# EAGLE design projetEagleElecGroupeD (EAGLE 9.6.2)
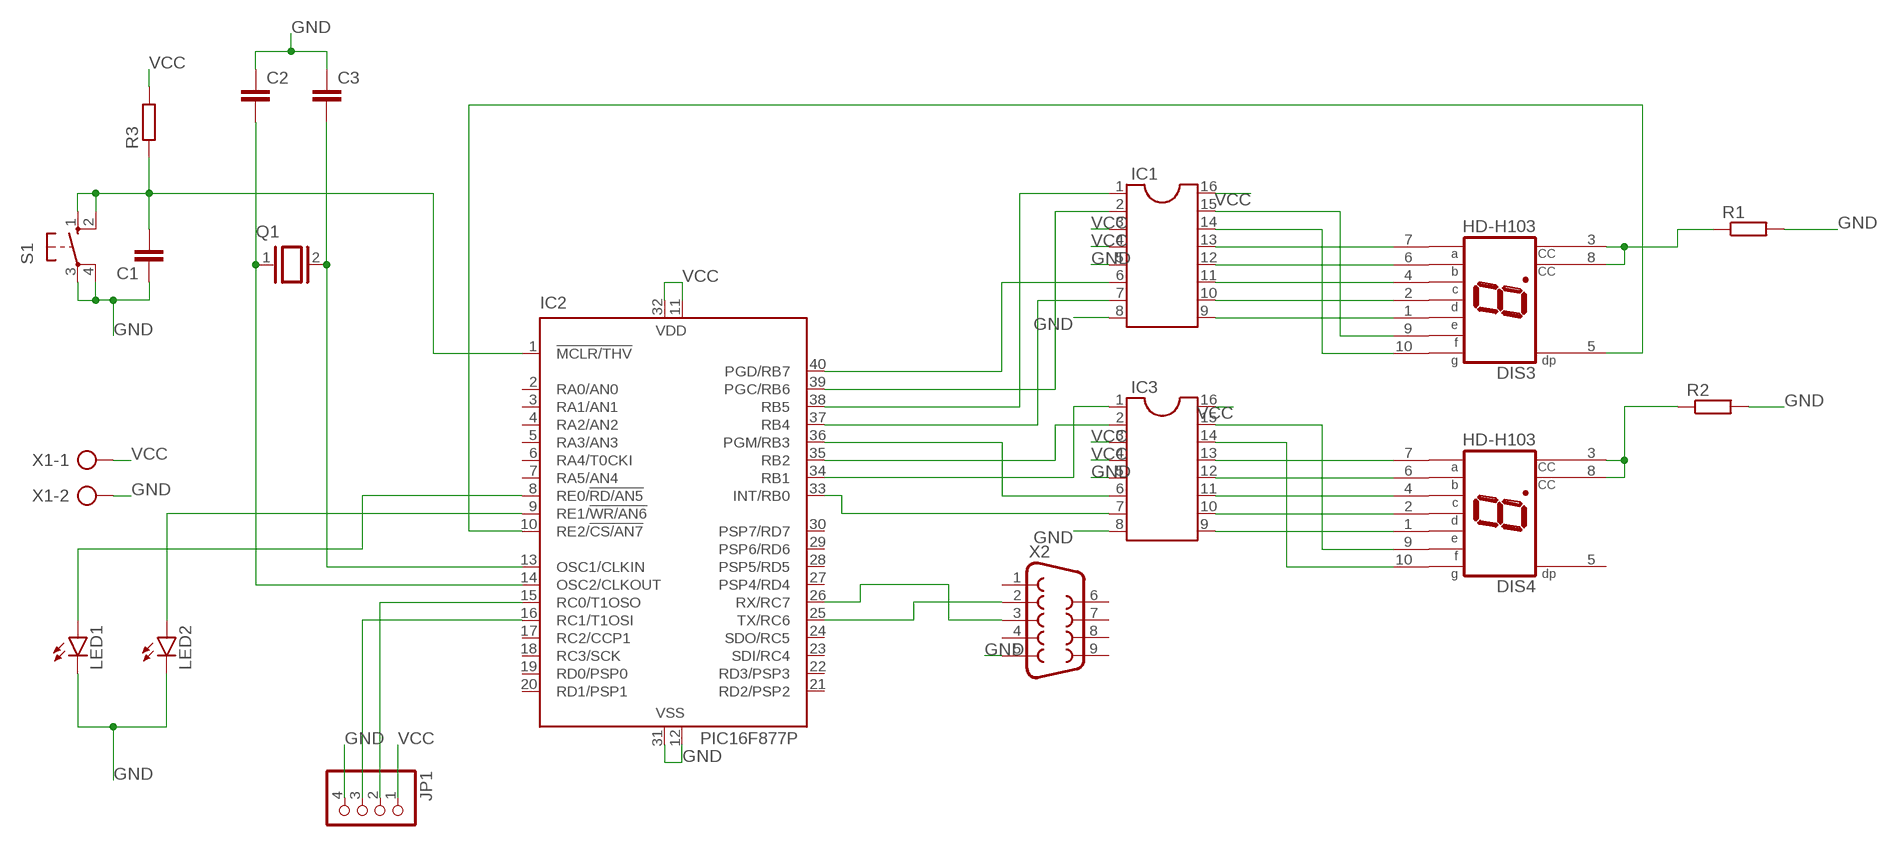
[diagram p0: schematic, sheet 1]

## Parts
C1  C-EU025-025X050  [C025-025X050]
C2  C-EU025-025X050  [C025-025X050]
C3  C-EU025-025X050  [C025-025X050]
DIS3  HD-H103  [HDSP-M]
DIS4  HD-H103  [HDSP-M]
IC1  DIL16  [DIL16]
IC2  PIC16F877P  [DIL40]
IC3  DIL16  [DIL16]
JP1  PINHD-1X4  [1X04]
LED1  LED5MM  [LED5MM]
LED2  LED5MM  [LED5MM]
Q1  XTAL/S  [QS]
R1  R-EU_0207/10  [0207/10]
R2  R-EU_0207/10  [0207/10]
R3  R-EU_0207/10  [0207/10]
S1  10-XX  [B3F-10XX]
X1  AK300/2  [AK300/2]
X2  F09H  [F09H]

## Nets
GND: C1.1 C2.1 C3.1 IC1.5 IC1.8 IC2.12(VSS) IC2.31(VSS) IC3.5 IC3.8 JP1.4 LED1.K(C) LED2.K(C) R1.2 R2.2 S1.3(P) S1.4(P1) X1.2 X2.5
N$1: IC2.25(TX/RC6) X2.2
N$2: IC2.26(RX/RC7) X2.3
N$3: IC1.7 IC2.37(RB4)
N$4: IC1.1 IC2.38(RB5)
N$5: IC1.2 IC2.39(PGC/RB6)
N$6: IC1.6 IC2.40(PGD/RB7)
N$7: IC2.33(INT/RB0) IC3.7
N$8: IC2.34(RB1) IC3.1
N$9: IC2.35(RB2) IC3.2
N$10: IC2.36(PGM/RB3) IC3.6
N$11: DIS3.5(DP) IC2.10(RE2/!CS/AN7)
N$12: C1.2 IC2.1(!MCLR/THV) R3.1 S1.1(S) S1.2(S1)
N$13: DIS4.3(CC) DIS4.8(CC) R2.1
N$14: C3.2 IC2.13(OSC1/CLKIN) Q1.2
N$15: C2.2 IC2.14(OSC2/CLKOUT) Q1.1
N$16: DIS3.3(CC) DIS3.8(CC) R1.1
N$17: DIS3.7(A) IC1.13
N$18: DIS3.6(B) IC1.12
N$19: DIS3.4(C) IC1.11
N$20: DIS3.2(D) IC1.10
N$21: DIS3.1(E) IC1.9
N$22: DIS3.9(F) IC1.15
N$23: DIS3.10(G) IC1.14
N$24: DIS4.7(A) IC3.13
N$25: DIS4.6(B) IC3.12
N$26: DIS4.4(C) IC3.11
N$27: DIS4.2(D) IC3.10
N$28: DIS4.1(E) IC3.9
N$29: DIS4.9(F) IC3.15
N$30: DIS4.10(G) IC3.14
N$31: IC2.15(RC0/T1OSO) JP1.2
N$32: IC2.16(RC1/T1OSI) JP1.3
N$33: IC2.9(RE1/!WR/AN6) LED2.A
N$34: IC2.8(RE0/!RD/AN5) LED1.A
VCC: IC1.3 IC1.4 IC1.16 IC2.11(VDD) IC2.32(VDD) IC3.3 IC3.4 IC3.16 JP1.1 R3.2 X1.1
Unconnected: DIS4.5(DP) IC2.2(RA0/AN0) IC2.3(RA1/AN1) IC2.4(RA2/AN2) IC2.5(RA3/AN3) IC2.6(RA4/T0CKI) IC2.7(RA5/AN4) IC2.17(RC2/CCP1) IC2.18(RC3/SCK) IC2.19(RD0/PSP0) IC2.20(RD1/PSP1) IC2.21(RD2/PSP2) IC2.22(RD3/PSP3) IC2.23(SDI/RC4) IC2.24(SDO/RC5) IC2.27(PSP4/RD4) IC2.28(PSP5/RD5) IC2.29(PSP6/RD6) IC2.30(PSP7/RD7) X2.1 X2.4 X2.6 X2.7 X2.8 X2.9

## Library data of the parts
C1-C3 = rcl:C-EU: CAPACITOR, European symbol; SPICEPREFIX: C
DIS3 DIS4 = display-hp:HD-H103: LED DISPLAY 1-character 7 segment, decimal point right; OC_FARNELL: unknown; OC_NEWARK: unknown
IC1 IC3 = ic-package:DIL16: Dual In Line / Socket
IC2 = microchip:PIC16F87*: MICROCONTROLLER; MF: MICROCHIP; MPN: PIC16F877-04/P; OC_FARNELL: 9761349; OC_NEWARK: 61K3463
JP1 = pinhead:PINHD-1X4: PIN HEADER
LED1 LED2 = led:LED: LED OSRAM: - CHIPLED LG R971, LG N971, LY N971, LG Q971, LY Q971, LO R971, LY R971 LH N974, LH R974 LS Q976, LO Q976, LY Q976 LO Q996 - Hyper CHIPLED LW Q18S LB Q993, LB Q99A, LB R99A - SideLED LS A670, LO A670, LY A670, LG A670, LP A670 LB A673, LV A673, LT A673, LW A673 LH A674 LY A675 LS A676, LA A676, LO A676, LY A676, LW A676 LS A679, LY A679, LG A679 - Hyper Micro SIDELED® LS Y876, LA Y876, LO Y876, LY Y876 LT Y87S - SmartLED LW L88C, LW L88S LB L89C, LB L89S, LG L890 LS L89K, LO L89K, LY L89K LS L896, LA L896, LO L896, LY L896 - TOPLED LS T670, LO T670, LY T670, LG T670, LP T670 LSG T670, LSP T670, LSY T670, LOP T670, LYG T670 LG T671, LOG T671, LSG T671 LB T673, LV T673, LT T673, LW T673 LH T674 LS T676, LA T676, LO T676, LY T676, LB T676, LH T676, LSB T676, LW T676 LB T67C, LV T67C, LT T67C, LS T67K, LO T67K, LY T67K, LW E67C LS E67B, LA E67B, LO E67B, LY E67B, LB E67C, LV E67C, LT E67C LW T67C LS T679, LY T679, LG T679 LS T770, LO T770, LY T770, LG T770, LP T770 LB T773, LV T773, LT T773, LW T773 LH T774 LS E675, LA E675, LY E675, LS T675 LS T776, LA T776, LO T776, LY T776, LB T776 LHGB T686 LT T68C, LB T68C - Hyper Mini TOPLED® LB M676 - Mini TOPLED Santana® LG M470 LS M47K, LO M47K, LY M47K Source: http://www.osram.convergy.de LUXEON: - LUMILED® LXK2-PW12-R00, LXK2-PW12-S00, LXK2-PW14-U00, LXK2-PW14-V00 LXK2-PM12-R00, LXK2-PM12-S00, LXK2-PM14-U00 LXK2-PE12-Q00, LXK2-PE12-R00, LXK2-PE12-S00, LXK2-PE14-T00, LXK2-PE14-U00 LXK2-PB12-K00, LXK2-PB12-L00, LXK2-PB12-M00, LXK2-PB14-N00, LXK2-PB14-P00, LXK2-PB14-Q00 LXK2-PR12-L00, LXK2-PR12-M00, LXK2-PR14-Q00, LXK2-PR14-R00 LXK2-PD12-Q00, LXK2-PD12-R00, LXK2-PD12-S00 LXK2-PH12-R00, LXK2-PH12-S00 LXK2-PL12-P00, LXK2-PL12-Q00, LXK2-PL12-R00 Source: www.luxeon.com KINGBRIGHT: KA-3528ASYC Source: www.kingbright.com
Q1 = special:XTAL/S: CRYSTAL
R1-R3 = rcl:R-EU_: RESISTOR, European symbol; SPICEPREFIX: R
S1 = switch-omron:10-XX: OMRON SWITCH; MPN: B3F-1000; OC_FARNELL: 176432; OC_NEWARK: 36M3542
X1 = con-ptr500:AK300/2: CONNECTOR; OC_FARNELL: unknown; OC_NEWARK: unknown
X2 = con-subd:F09: SUB-D; OC_FARNELL: unknown; OC_NEWARK: unknown

## Board
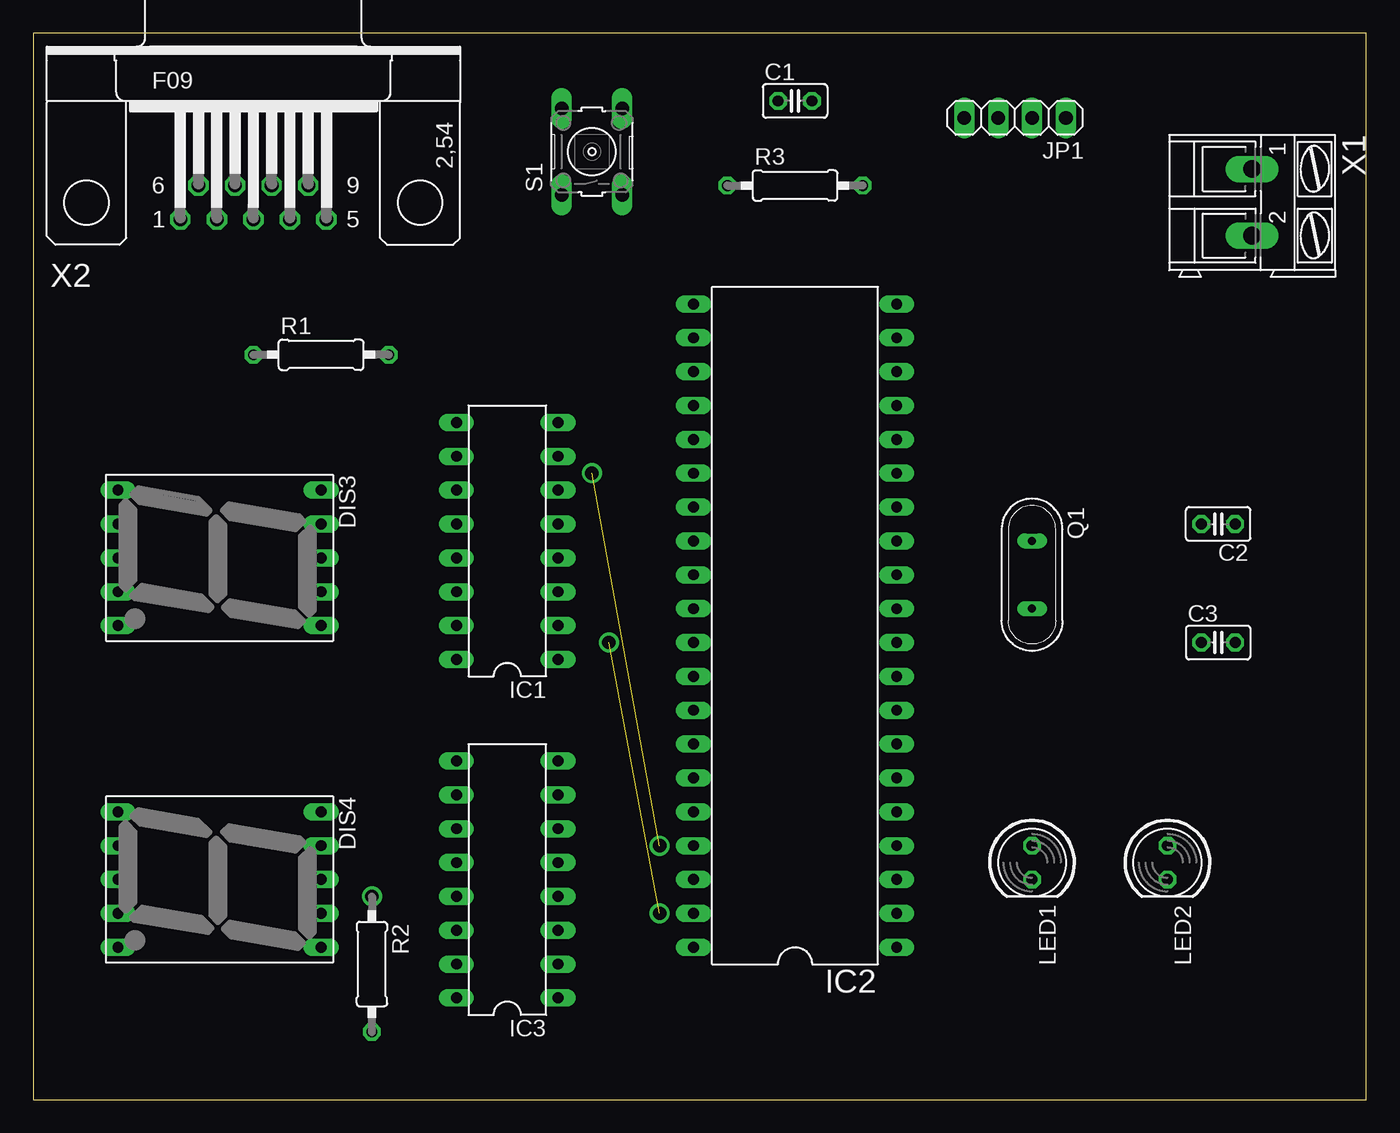
[diagram p1: board, top side]
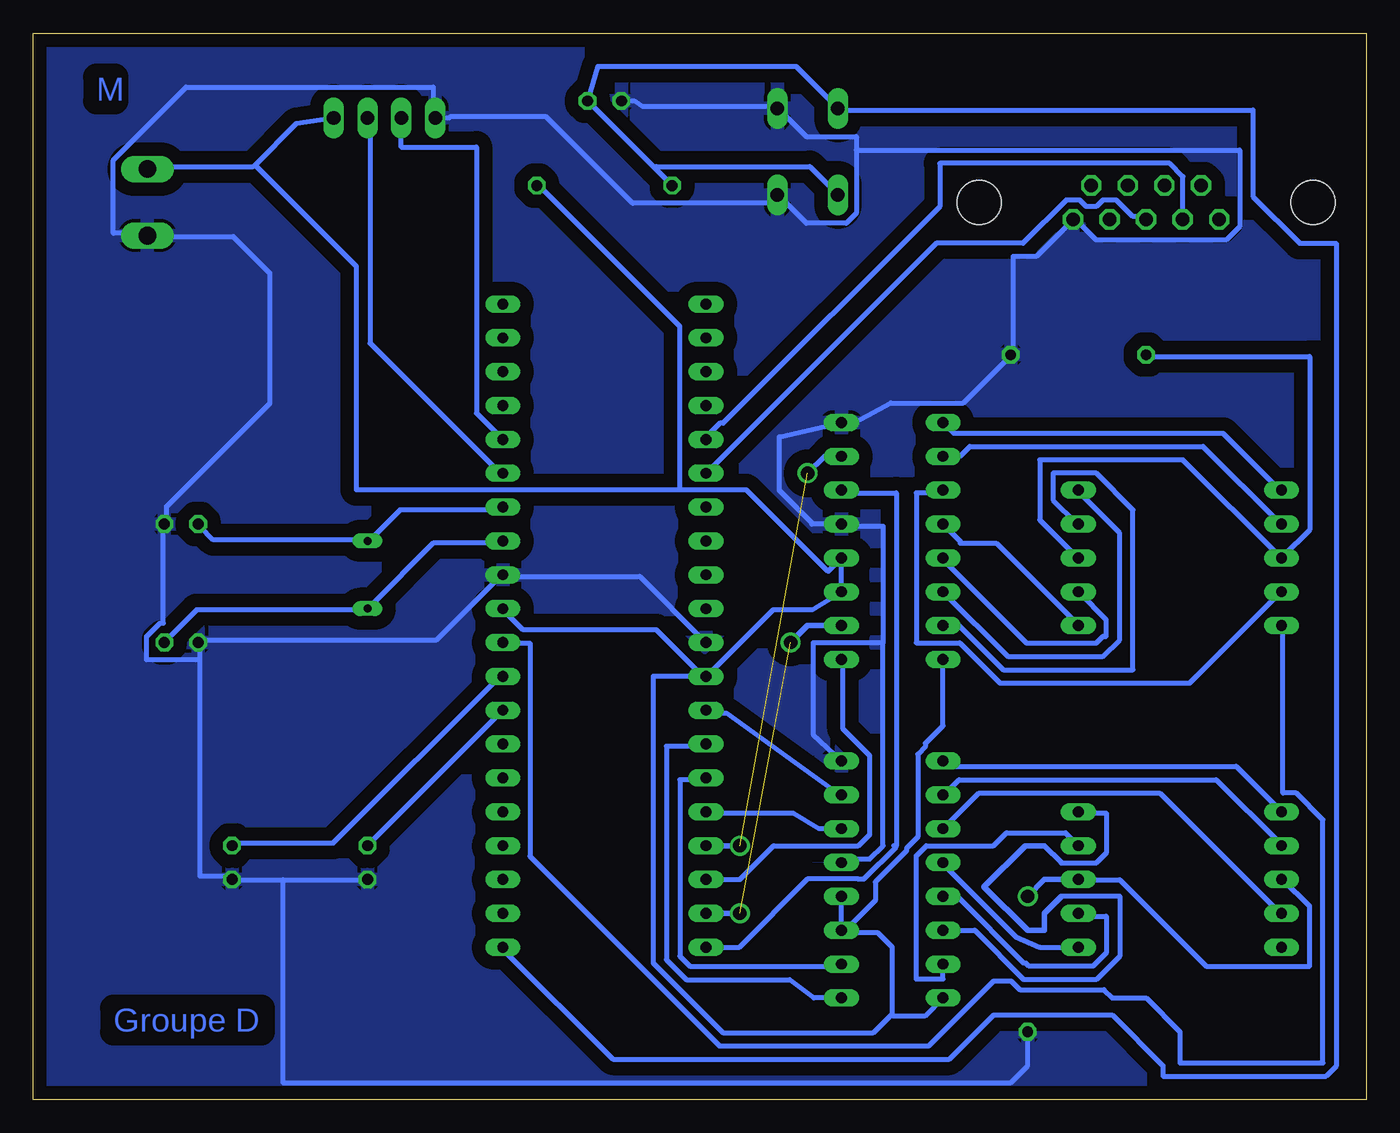
[diagram p2: board, bottom side, seen from below]

Size 100 x 80 mm. Coordinates in mm from the lower left corner, seen from the top.
Outline: 0,0 100,0 100,80 0,80 0,0
Copper layers (1*16): Top 0.035mm / dielectric 1.5mm / Bottom 0.035mm
Design rules "default *": minimum track width 15mil, minimum drill 0.35mm, track to track 15mil, track to pad 15mil, pad to pad 15mil, via to via 15mil, smd to smd 15mil, copper to edge 40mil, drill to drill 6mil, minimum pad ring 10mil, minimum via ring 8mil, stop-mask expansion 4mil, vias tented up to drill 0mil, thermal gap 10mil

### Footprints (pad centres in the part's own frame; a part is rotated, then mirrored left to right if it is on the bottom)
C025-025X050 = drill 0.813 octagon: 1 -1.27,0; 2 1.27,0
HDSP-M = drill 0.813 long: 1 -5.08,-7.62; 2 -2.54,-7.62; 3 0,-7.62; 4 2.54,-7.62; 5 5.08,-7.62; 6 5.08,7.62; 7 2.54,7.62; 8 0,7.62; 9 -2.54,7.62; 10 -5.08,7.62
DIL16 = drill 0.813 long: 1 -8.89,-3.81; 2 -6.35,-3.81; 3 -3.81,-3.81; 4 -1.27,-3.81; 5 1.27,-3.81; 6 3.81,-3.81; 7 6.35,-3.81; 8 8.89,-3.81; 9 8.89,3.81; 10 6.35,3.81; 11 3.81,3.81; 12 1.27,3.81; 13 -1.27,3.81; 14 -3.81,3.81; 15 -6.35,3.81; 16 -8.89,3.81
DIL40 = drill 0.813 long: 1 -24.13,-7.62; 2 -21.59,-7.62; 3 -19.05,-7.62; 4 -16.51,-7.62; 5 -13.97,-7.62; 6 -11.43,-7.62; 7 -8.89,-7.62; 8 -6.35,-7.62; 9 -3.81,-7.62; 10 -1.27,-7.62; 11 1.27,-7.62; 12 3.81,-7.62; 13 6.35,-7.62; 14 8.89,-7.62; 15 11.43,-7.62; 16 13.97,-7.62; 17 16.51,-7.62; 18 19.05,-7.62; 19 21.59,-7.62; 20 24.13,-7.62; 21 24.13,7.62; 22 21.59,7.62; 23 19.05,7.62; 24 16.51,7.62; 25 13.97,7.62; 26 11.43,7.62; 27 8.89,7.62; 28 6.35,7.62; 29 3.81,7.62; 30 1.27,7.62; 31 -1.27,7.62; 32 -3.81,7.62; 33 -6.35,7.62; 34 -8.89,7.62; 35 -11.43,7.62; 36 -13.97,7.62; 37 -16.51,7.62; 38 -19.05,7.62; 39 -21.59,7.62; 40 -24.13,7.62
1X04 = drill 1.016 long: 1 -3.81,0; 2 -1.27,0; 3 1.27,0; 4 3.81,0
LED5MM = drill 0.813 octagon: A -1.27,0; K 1.27,0
QS = drill 0.61 long: 1 -2.54,0; 2 2.54,0
0207/10 = drill 0.813 octagon: 1 -5.08,0; 2 5.08,0
B3F-10XX = drill 1.016 long: 1 -3.251,2.261; 2 3.251,2.261; 3 -3.251,-2.261; 4 3.251,-2.261
AK300/2 = drill 1.321 long: 1 -2.515,0; 2 2.489,0
F09H = drill 1.016 octagon: 1 -5.486,-1.27; 2 -2.743,-1.27; 3 0,-1.27; 4 2.743,-1.27; 5 5.486,-1.27; 6 -4.115,1.27; 7 -1.372,1.27; 8 1.372,1.27; 9 4.115,1.27 | hole 3.302: -12.522,0; 12.522,0

### Placement (x,y rotation side)
C1  57.15,74.93 0 top
C2  88.9,43.18 180 top
C3  88.9,34.29 0 top
DIS3  13.97,40.64 270 top
DIS4  13.97,16.51 270 top
IC1  35.56,41.91 90 top
IC2  57.15,35.56 90 top
IC3  35.56,16.51 90 top
JP1  73.66,73.66 180 top
LED1  74.93,17.78 270 top
LED2  85.09,17.78 270 top
Q1  74.93,39.37 270 top
R1  21.59,55.88 0 top
R2  25.4,10.16 270 top
R3  57.15,68.58 0 top
S1  41.91,71.12 90 top
X1  91.44,67.31 270 top
X2  16.51,67.31 0 top

### Tracks (layer width: path | path; a pad name or v marks a point on that pad's centre or on a via)
GND
  Bottom 0.381: IC3.5 39.11,18.04 37.26,18.04 36.25,19.05 36.25,34.27 | 36.25,34.27 36.25,43.02 39.21,43.02 IC1.5 41.6,43.18 41.6,43.28 44.04,45.72 44.04,49.72 IC1.8 38.37,50.8 35.67,52.27 30.23,52.27 26.75,55.75 R1.2 26.5,56 26.5,63.25 24.75,63.25 22,66 X2.5 21.75,66 20.25,64.5 10.5,64.5 9.5,65.5 9.5,71.25 38.25,71.25 | 36.25,34.27 41.5,34.27 41.5,27.38 IC3.8 | C1.1 54.91,74.93 54.25,74.5 44.25,74.5 S1.4 44,74.25 42,72.25 38.25,72.25 38.25,71.25 | 38.25,71.25 38.25,66.5 39,65.75 42,65.75 44,67.75 S1.3 43.75,67.25 55.04,67.25 61.52,73.73 68.75,73.73 68.78,73.66 JP1.4 70,73.71 70,75.96 88.54,75.96 94,70.5 94,65 91.5,65 X1.2 91.25,64.75 85,64.75 82.26,62.01 82.26,52.24 90,44.5 90,43.25 C2.1 90.25,43 90.25,35.75 90.5,35.75 91.5,34.75 91.5,33 87.5,33 | IC2.31 49.75,34.5 54.5,39.25 64.75,39.25 IC2.12 65,39.25 69.75,34.5 87.5,34.5 C3.1 87.5,34.25 87.5,33 | 81.28,16.5 85,16.5 LED2.K 85.25,16.75 87.5,16.75 87.5,33 | 81.28,16.5 75,16.5 LED1.K | 81.28,16.5 81.28,1.27 26.67,1.27 25.4,2.54 R2.2
  pour Bottom (isolate 1.016): 0,80.01 100.33,80.01 100.33,0 0,0
N$1
  Bottom 0.381: IC2.25 49.5,49.75 48.5,50.75 48.25,50.75 32,67 32,70.25 14.75,70.25 13.75,69.25 13.75,66.25 X2.2
N$2
  Bottom 0.381: IC2.26 49.5,47 32.25,64.25 25.75,64.25 22.5,67.5 21.5,67.5 21,67 20.25,67 19.75,67.5 18.75,67.5 17.5,66.25 16.75,66.25 X2.3
N$3  (via drill 1 pad 1.3)  (1 unrouted)
  Bottom 0.406: v41.91,46.99 40.64,48.26 IC1.7 | IC2.37 v46.99,19.05
N$4
  Bottom 0.381: IC2.38 46.99,16.51 44.46,19.04 38.1,19.04 37.25,19.89 37.25,25.79 39.25,27.79 39.25,33.02 IC1.1
N$5  (via drill 1 pad 1.3)  (1 unrouted)
  Bottom 0.406: IC2.39 v46.99,13.97 | v43.18,34.29 41.91,35.56 IC1.2
N$6
  Bottom 0.381: IC2.40 47.03,11.43 41.92,16.54 38.1,16.54 37.68,16.54 35.26,18.96 35.26,19.05 | IC1.6 38.91,45.26 38.49,45.52 35.25,45.52 35.25,19.05 35.26,19.05 | 35.43,19.05 35.26,19.05
N$7
  Bottom 0.381: IC3.7 39.5,22.86 48,29 49.5,29 IC2.33
N$8
  Bottom 0.381: IC3.1 41.45,7.62 43.25,9 51,9 52.5,10.5 52.5,26.5 49.75,26.5 IC2.34
N$9
  Bottom 0.381: IC3.2 39.53,10 50.75,10 51.5,10.75 51.5,24 49.75,24 IC2.35
N$10
  Bottom 0.381: IC3.6 41,20.32 43,21.5 49.5,21.5 IC2.36
N$11
  Bottom 0.381: DIS3.5 6.25,35.5 6.25,23 5.25,23 3.25,21 3.25,2.75 13.97,2.75 13.97,5.08 16.51,7.62 19.05,7.62 19.67,8.24 25.99,8.24 26.64,8.89 27.94,8.89 32.81,4.02 48.52,4.02 62.75,18.25 62.75,34.25 64.75,34.25 IC2.10
N$12
  Bottom 0.381: 53.38,69.88 58.25,74.75 58.31,74.82 C1.2 57.66,77.5 42.75,77.5 39.75,74.5 S1.2 39.5,74.25 8.5,74.25 8.5,67.75 5,64.25 2.25,64.25 2.25,2.5 3,1.75 15.24,1.75 15.24,2.54 19.05,6.35 27.94,6.35 31.27,3.02 56.52,3.02 64.75,11.25 IC2.1 | 53.38,69.88 52.25,68.75 R3.1 | S1.1 39.75,68 41.75,70 53.25,70 53.38,69.88
N$13  (via drill 1 pad 1.3)
  Bottom 0.381: DIS4.3 6.25,16.5 4.25,14.5 4.25,10 12,10 18.5,16.5 21.5,16.5 DIS4.8
  Bottom 0.406: R2.1 24.13,16.51 DIS4.8
  other vias: 25.4,15.24
N$14
  Bottom 0.381: IC2.13 65,41.75 70,41.75 74.75,37 Q1.2 75,36.75 87.75,36.75 90,34.5 C3.2
N$15
  Bottom 0.381: IC2.14 65,44.25 72.5,44.25 74.75,42 Q1.1 75,42 86.5,42 87.5,43 C2.2
N$16
  Bottom 0.381: R1.1 16.5,55.75 4.25,55.75 4.25,42.75 6.25,40.75 DIS3.3 6.5,40.75 13.75,48 24.5,48 24.5,43.5 21.75,40.75 DIS3.8
N$17
  Bottom 0.381: DIS3.7 21.5,38 19.5,36 19.5,34.75 19.75,34.75 20.25,34.25 25.48,34.25 31.75,40.52 IC1.13
N$18
  Bottom 0.381: DIS3.6 21.75,35.75 27.75,41.75 30.48,41.75 30.48,41.91 IC1.12
N$19
  Bottom 0.381: DIS3.4 6.5,38 13.25,31.25 27.48,31.25 30.5,34.27 33.75,34.27 33.75,45.52 31.75,45.52 IC1.11
N$20
  Bottom 0.381: DIS3.2 6.5,43.25 12.25,49 29.75,49 30.49,48.26 IC1.10
N$21
  Bottom 0.381: DIS3.1 6.5,45.75 10.75,50 30.95,50 IC1.9
N$22
  Bottom 0.381: IC1.15 30.54,35.56 27.23,32.25 17.5,32.25 17.5,44.25 20.25,47 23.5,47 23.5,45 21.75,43.25 DIS3.9
N$23
  Bottom 0.381: IC1.14 26.9,33.25 19.75,33.25 18.5,34.5 18.5,42.5 21.5,45.5 DIS3.10
N$24
  Bottom 0.381: IC3.13 30.68,15.24 25.67,10.23 25.52,10.23 25.29,10 20.5,10 19.5,11 19.5,13.75 21.5,13.75 DIS4.7
N$25
  Bottom 0.381: DIS4.6 24.49,11.43 26.27,12.21 31.6,17.54 31.75,17.54 IC3.12
N$26
  Bottom 0.381: DIS4.4 6.5,14 15.5,23 29.04,23 31.75,20.29 IC3.11
N$27
  Bottom 0.381: DIS4.2 6.5,19.25 11.25,24 30.54,24 31.75,22.79 IC3.10
N$28
  Bottom 0.381: DIS4.1 6.5,21.75 9.75,25 31.35,25 IC3.9
N$29
  Bottom 0.381: DIS4.9 22.56,20.02 26.98,20.02 27.96,19.04 33,19.04 33.75,18.29 33.75,9.02 31.75,9.02 IC3.15
N$30
  Bottom 0.381: IC3.14 29.37,12.7 25.67,9 20.25,9 18.5,10.75 18.5,15.25 22.86,15.25 | 22.86,17.75 20.25,17.75 19.5,18.5 19.5,21.5 21.5,21.5 DIS4.10
  Bottom 0.406: 22.86,15.25 24.13,13.98 24.13,12.7 25.4,12.7 28.67,15.97 25.58,19.05 24.13,19.05 22.86,17.78 22.86,17.75
N$31
  Bottom 0.381: IC2.15 65,47 74.75,56.75 74.75,73.46 JP1.2
N$32
  Bottom 0.381: IC2.16 65,49.75 66.75,51.5 66.75,71.46 72.39,71.46 JP1.3
N$33
  Bottom 0.381: IC2.9 65,31.75 77.5,19.25 85,19.25 LED2.A
N$34
  Bottom 0.381: LED1.A 74.75,19.25 65,29 IC2.8
VCC
  Bottom 0.381: 35.56,6.31 35.62,6.38 36.98,5.02 48.27,5.02 53.5,10.25 53.5,31.75 IC2.32 | IC3.16 33.12,6.25 35.5,6.25 35.56,6.31 | 39.5,15.04 IC3.4 IC3.3 | IC3.3 39.37,12.69 39.5,12.5 36.63,12.5 35.56,11.43 35.56,6.31 | IC1.16 31.75,28.04 33.07,26.72 33.07,26.48 33.64,25.91 33.64,19.7 34.49,18.85 34.49,18.66 36.83,16.32 36.83,14.94 39.07,12.7 IC3.3 | 83.38,70.12 83.5,70 91.25,70 X1.1 | 83.38,70.12 80.26,73.24 JP1.1 | 39.5,38.27 IC1.3 | 39.5,40.52 IC1.4 | IC2.32 49.5,31.75 44.5,36.75 41.56,36.75 IC1.3 | 51.5,45.75 51.5,58 62,68.5 R3.2 | 51.5,45.75 46.5,45.75 40.38,39.63 IC1.4 | IC2.11 64.75,36.75 63.25,35.25 53.25,35.25 49.75,31.75 IC2.32 | 83.38,70.12 75.75,62.5 75.75,45.75 51.5,45.75 | IC1.3 IC1.4

### Text on the board
Bottom: M | Groupe D